# Altium schematic sheet Sheet2.SchDoc
size A; SheetNumber: 2; SheetTotal: 5
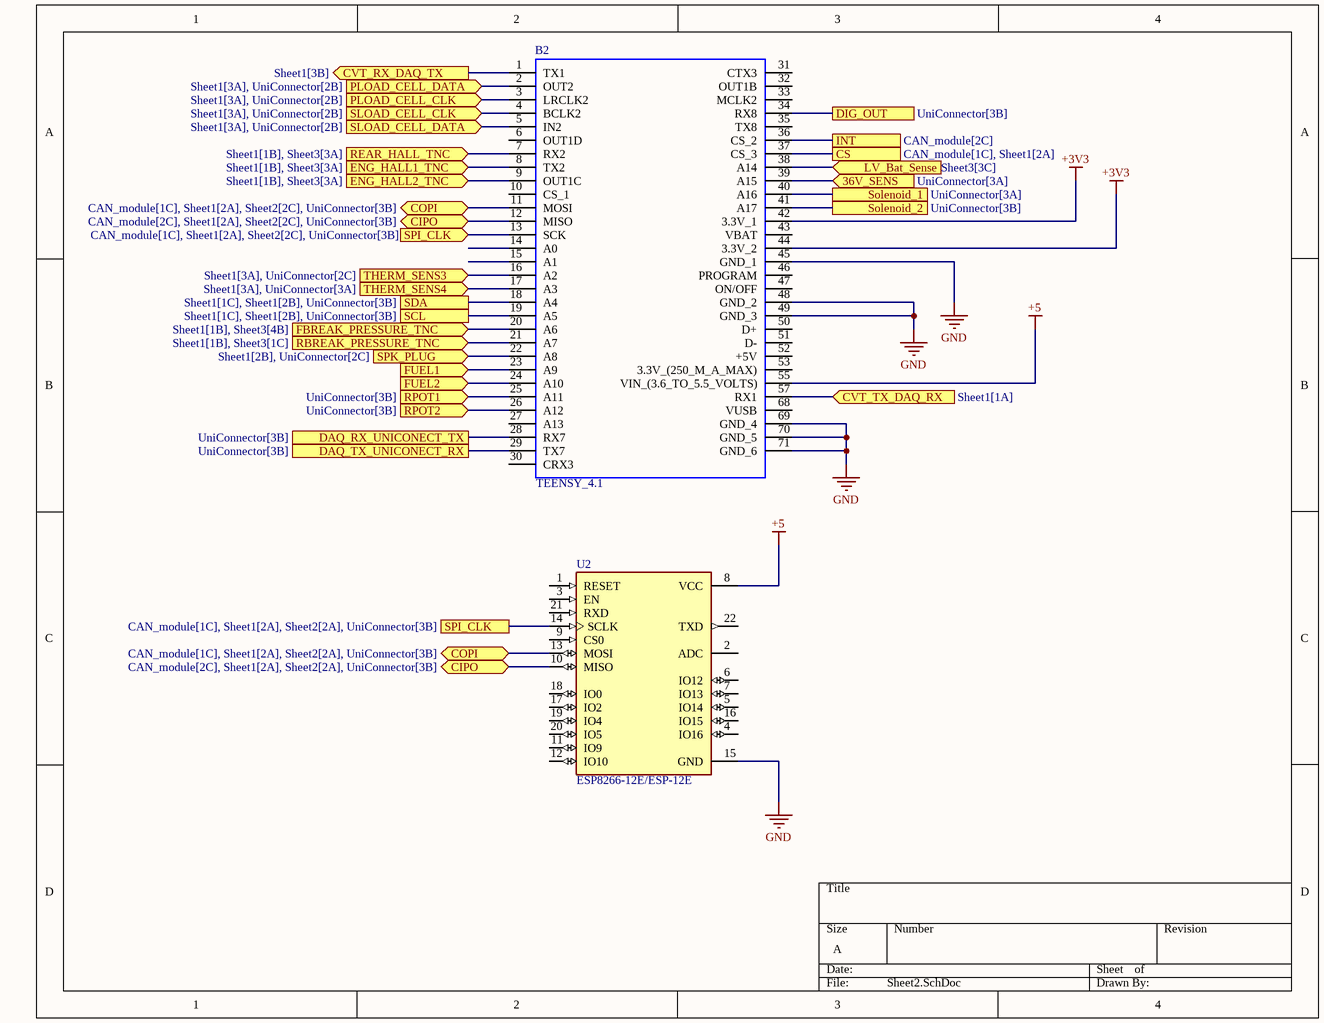
[diagram p0: Sheet2.SchDoc]

## Parts
B2  TEENSY_4.1  [TEENSY41]
U2  ESP8266-12E/ESP-12E  [XCVR_ESP8266-12E/ESP-12E]

## Ports
36V_SENS (in, see UniConnector[3A]), CIPO (bidir, see CAN_module[2C], Sheet1[2A], Sheet2[2A], UniConnector[3B]), CIPO (bidir, see CAN_module[2C], Sheet1[2A], Sheet2[2C], UniConnector[3B]), COPI (bidir, see CAN_module[1C], Sheet1[2A], Sheet2[2A], UniConnector[3B]), COPI (bidir, see CAN_module[1C], Sheet1[2A], Sheet2[2C], UniConnector[3B]), CS (see CAN_module[1C], Sheet1[2A]), CVT_RX_DAQ_TX (out, see Sheet1[3B]), CVT_TX_DAQ_RX (in, see Sheet1[1A]), DAQ_RX_UNICONECT_TX (see UniConnector[3B]), DAQ_TX_UNICONECT_RX (see UniConnector[3B]), DIG_OUT (see UniConnector[3B]), ENG_HALL1_TNC (in, see Sheet1[1B], Sheet3[3A]), ENG_HALL2_TNC (in, see Sheet1[1B], Sheet3[3A]), FBREAK_PRESSURE_TNC (in, see Sheet1[1B], Sheet3[4B]), FUEL1 (in), FUEL2 (in), INT (see CAN_module[2C]), LV_Bat_Sense (in, see Sheet3[3C]), PLOAD_CELL_CLK (in, see Sheet1[3A], UniConnector[2B]), PLOAD_CELL_DATA (in, see Sheet1[3A], UniConnector[2B]), RBREAK_PRESSURE_TNC (in, see Sheet1[1B], Sheet3[1C]), REAR_HALL_TNC (in, see Sheet1[1B], Sheet3[3A]), RPOT1 (in, see UniConnector[3B]), RPOT2 (in, see UniConnector[3B]), SCL (see Sheet1[1C], Sheet1[2B], UniConnector[3B]), SDA (see Sheet1[1C], Sheet1[2B], UniConnector[3B]), SLOAD_CELL_CLK (in, see Sheet1[3A], UniConnector[2B]), SLOAD_CELL_DATA (in, see Sheet1[3A], UniConnector[2B]), Solenoid_1 (see UniConnector[3A]), Solenoid_2 (see UniConnector[3B]), SPI_CLK (in, see CAN_module[1C], Sheet1[2A], Sheet2[2C], UniConnector[3B]), SPI_CLK (see CAN_module[1C], Sheet1[2A], Sheet2[2A], UniConnector[3B]), SPK_PLUG (in, see Sheet1[2B], UniConnector[2C]), THERM_SENS3 (in, see Sheet1[3A], UniConnector[2C]), THERM_SENS4 (in, see Sheet1[3A], UniConnector[3A])

## Nets
+3V3: B2.42(3.3V_1) B2.44(3.3V_2)
+5: B2.55(VIN_(3.6_TO_5.5_VOLTS)) U2.8(VCC)
GND: B2.45(GND_1) B2.48(GND_2) B2.49(GND_3) B2.69(GND_4) B2.70(GND_5) B2.71(GND_6) U2.15(GND)
36V_SENS: B2.39(A15) ; port 36V_SENS
CIPO: B2.12(MISO) U2.10(MISO) ; port CIPO
COPI: B2.11(MOSI) U2.13(MOSI) ; port COPI
CS: B2.37(CS_3) ; port CS
CVT_RX_DAQ_TX: B2.1(TX1) ; port CVT_RX_DAQ_TX
CVT_TX_DAQ_RX: B2.57(RX1) ; port CVT_TX_DAQ_RX
DAQ_RX_UNICONECT_TX: B2.28(RX7) ; port DAQ_RX_UNICONECT_TX
DAQ_TX_UNICONECT_RX: B2.29(TX7) ; port DAQ_TX_UNICONECT_RX
DIG_OUT: B2.34(RX8) ; port DIG_OUT
ENG_HALL1_TNC: B2.8(TX2) ; port ENG_HALL1_TNC
ENG_HALL2_TNC: B2.9(OUT1C) ; port ENG_HALL2_TNC
FBREAK_PRESSURE_TNC: B2.20(A6) ; port FBREAK_PRESSURE_TNC
FUEL1: B2.23(A9) ; port FUEL1
FUEL2: B2.24(A10) ; port FUEL2
INT: B2.36(CS_2) ; port INT
LV_Bat_Sense: B2.38(A14) ; port LV_Bat_Sense
PLOAD_CELL_CLK: B2.3(LRCLK2) ; port PLOAD_CELL_CLK
PLOAD_CELL_DATA: B2.2(OUT2) ; port PLOAD_CELL_DATA
RBREAK_PRESSURE_TNC: B2.21(A7) ; port RBREAK_PRESSURE_TNC
REAR_HALL_TNC: B2.7(RX2) ; port REAR_HALL_TNC
RPOT1: B2.25(A11) ; port RPOT1
RPOT2: B2.26(A12) ; port RPOT2
SCL: B2.19(A5) ; port SCL
SDA: B2.18(A4) ; port SDA
SLOAD_CELL_CLK: B2.4(BCLK2) ; port SLOAD_CELL_CLK
SLOAD_CELL_DATA: B2.5(IN2) ; port SLOAD_CELL_DATA
Solenoid_1: B2.40(A16) ; port Solenoid_1
Solenoid_2: B2.41(A17) ; port Solenoid_2
SPI_CLK: B2.13(SCK) U2.14(SCLK) ; port SPI_CLK
SPK_PLUG: B2.22(A8) ; port SPK_PLUG
THERM_SENS3: B2.16(A2) ; port THERM_SENS3
THERM_SENS4: B2.17(A3) ; port THERM_SENS4

Not connected (* = marked no-connect by the designer): B2 6(OUT1D) 10(CS_1) 14(A0) 15(A1) 27(A13) 30(CRX3) 31(CTX3) 32(OUT1B) 33(MCLK2) 35(TX8) 43(VBAT) 46(PROGRAM) 47(ON/OFF) 50(D+) 51(D-) 52(+5V) 53(3.3V_(250_M_A_MAX)) 68(VUSB); U2 1(RESET) 2(ADC) 3(EN) 4(IO16) 5(IO14) 6(IO12) 7(IO13) 9(CS0) 11(IO9) 12(IO10) 16(IO15) 17(IO2) 18(IO0) 19(IO4) 20(IO5) 21(RXD) 22(TXD)

## Library data of the parts
B2 = TEENSY_4.1: Teensy 4.1 Development Board; Manufacturer_Name: PJRC; Manufacturer_Part_Number: TEENSY 4.1; Mouser Part Number: *; Mouser Price/Stock: *; Arrow Part Number: *; Arrow Price/Stock: *; Mouser Testing Part Number: *; Mouser Testing Price/Stock: *; Datasheet Link: https://www.pjrc.com/store/teensy41.html
U2 = ESP8266-12E/ESP-12E: This WiFi module has a 32-bit MCU micro and clock speeds supporting 80 MHz or 160 MHz. Supports the RTOS and integrated Wi-Fi MAC/BB/RF/PA/LNA, and has an on-board antenna.; MF: AI-Thinker; Value: *; SnapEDA_Link: https://www.snapeda.com/parts/ESP8266-12E/ESP-12E/AI-Thinker/view-part/?ref=snap; Availability: Not in stock; Price: None; Package: None; Check_prices: https://www.snapeda.com/parts/ESP8266-12E/ESP-12E/AI-Thinker/view-part/?ref=eda; MP: ESP8266-12E/ESP-12E